# EAGLE design W070 (EAGLE 6.6.0)
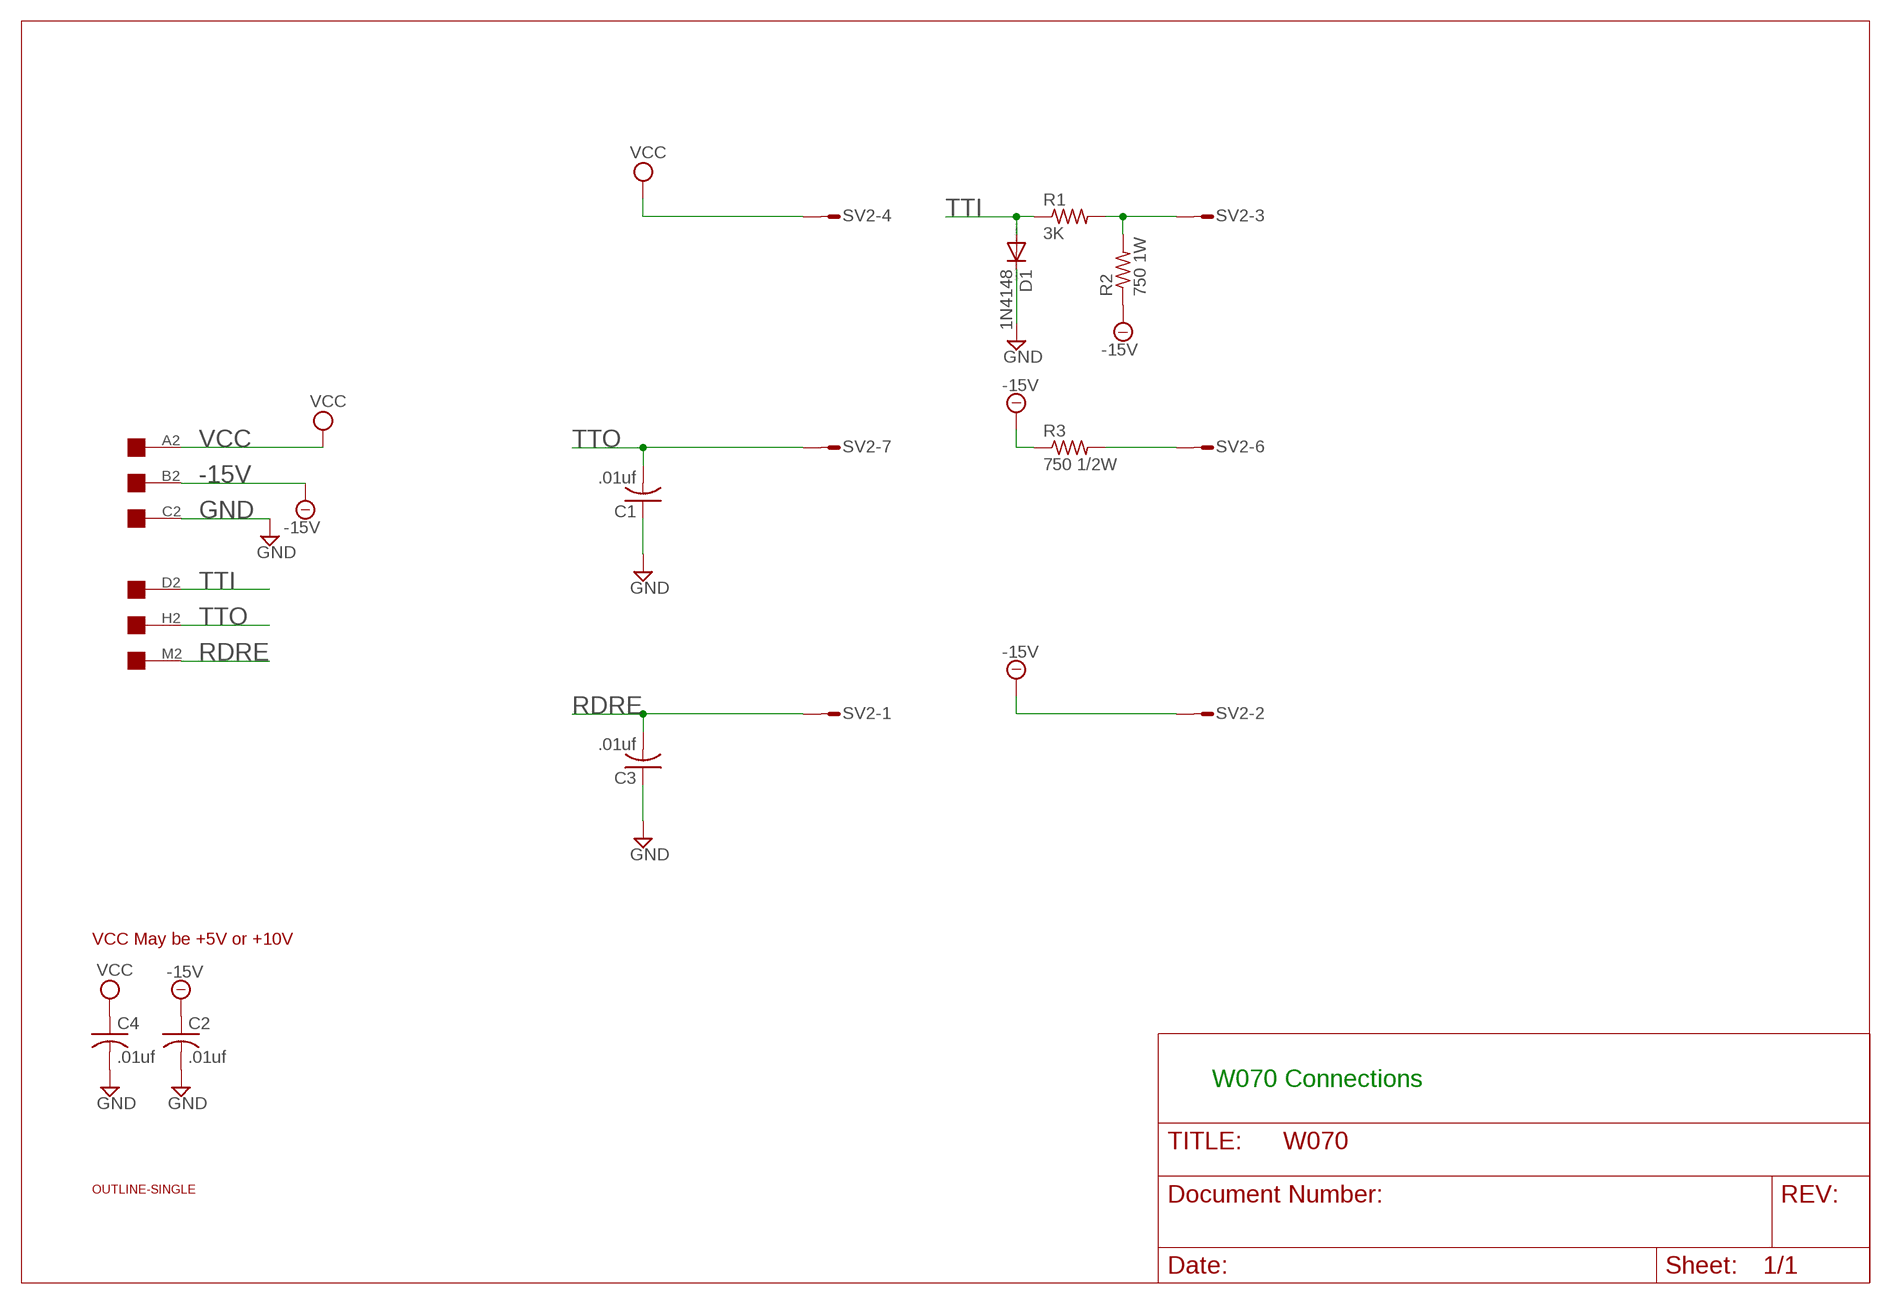
[diagram p0: schematic, sheet 1]

## Parts
C1  .01uf  C-US050-025X075  [C050-025X075]
C2  .01uf  C-US050-025X075  [C050-025X075]
C3  .01uf  C-US050-025X075  [C050-025X075]
C4  .01uf  C-US050-025X075  [C050-025X075]
D1  1N4148  1N4148DO35-10  [DO35-10]
EDGE  EDGE-1  [EDGE-CON1]
R1  3K  R-US_0207/10  [0207/10]
R2  750 1W  R-US_0309/12  [0309/12]
R3  750 1/2W  R-US_0309/12  [0309/12]
SV2  L08P  [L08P]
U$1  OUTLINE-SINGLE  [SINGLE]

## Nets
-15V: C2.1 EDGE.B2 R2.1 R3.1 SV2.2
GND: C1.1 C2.2 C3.1 C4.2 D1.C EDGE.C2
N$1: R3.2 SV2.6
N$2: R1.2 R2.2 SV2.3
RDRE: C3.2 EDGE.M2 SV2.1
TTI: D1.A EDGE.D2 R1.1
TTO: C1.2 EDGE.H2 SV2.7
VCC: C4.1 EDGE.A2 SV2.4
Unconnected: EDGE.E2 EDGE.F2 EDGE.J2 EDGE.K2 EDGE.L2 EDGE.N2 EDGE.P2 EDGE.R2 EDGE.S2 EDGE.T2 EDGE.U2 EDGE.V2 SV2.5 SV2.8

## Notes on the sheet
- VCC May be +5V or +10V
- W070 Connections

## Library data of the parts
C1-C4 = rcl:C-US: CAPACITOR, American symbol
D1 = diode:1N4148: DIODE high speed (Philips)
EDGE = dec-con:EDGE-1: Single-Sided DEC Edge Connector -- (side 2)
R1-R3 = rcl:R-US_: RESISTOR, American symbol
SV2 = con-amp-mt:L08P: AMP MT CONNECTOR; OC_FARNELL: unknown; OC_NEWARK: unknown
U$1 = dec-con:OUTLINE-*: Board outlines for DEC boards.

## Board
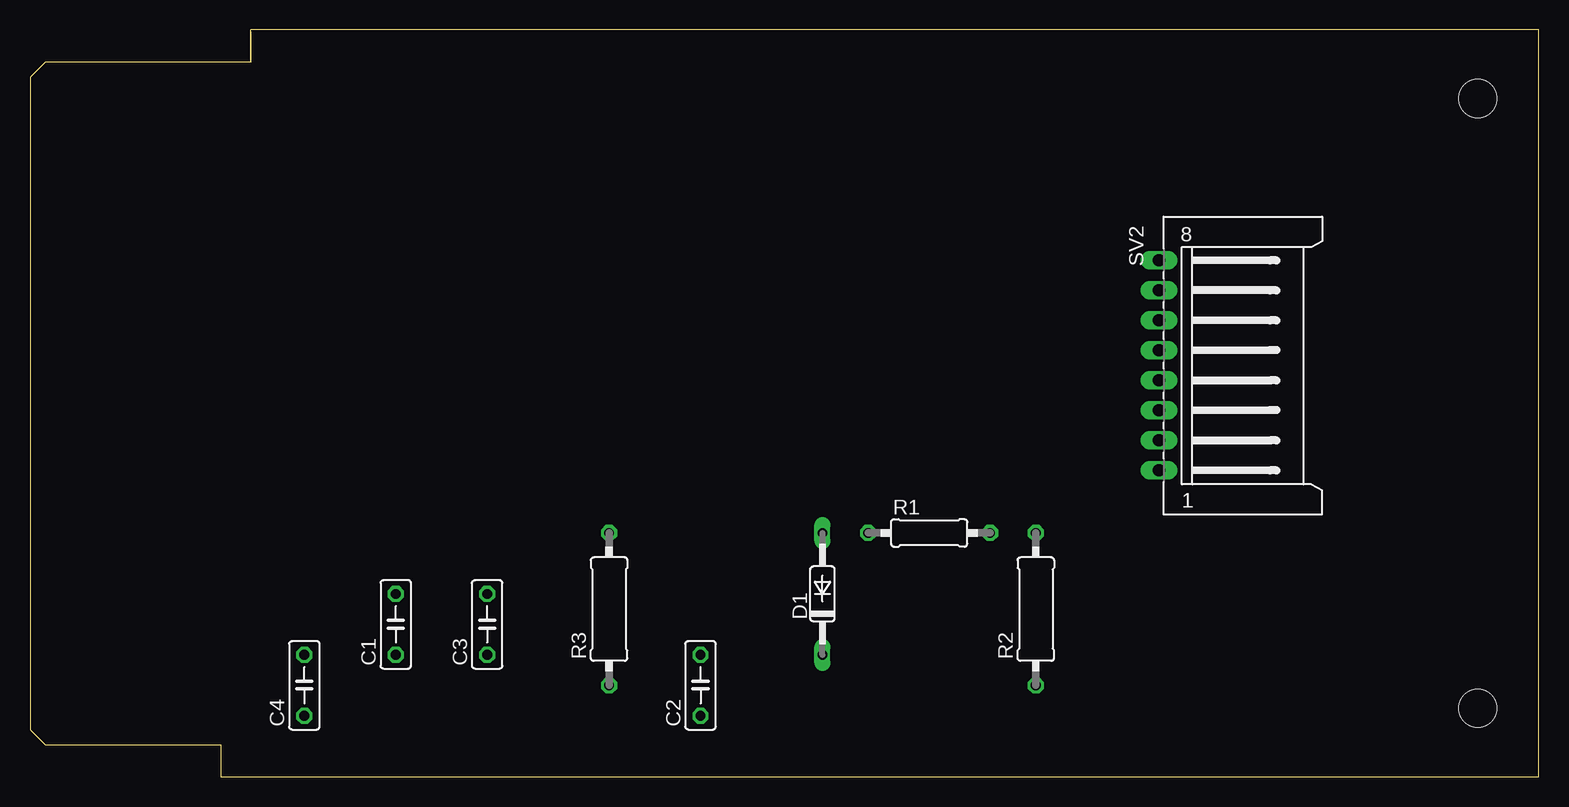
[diagram p1: board, top side]
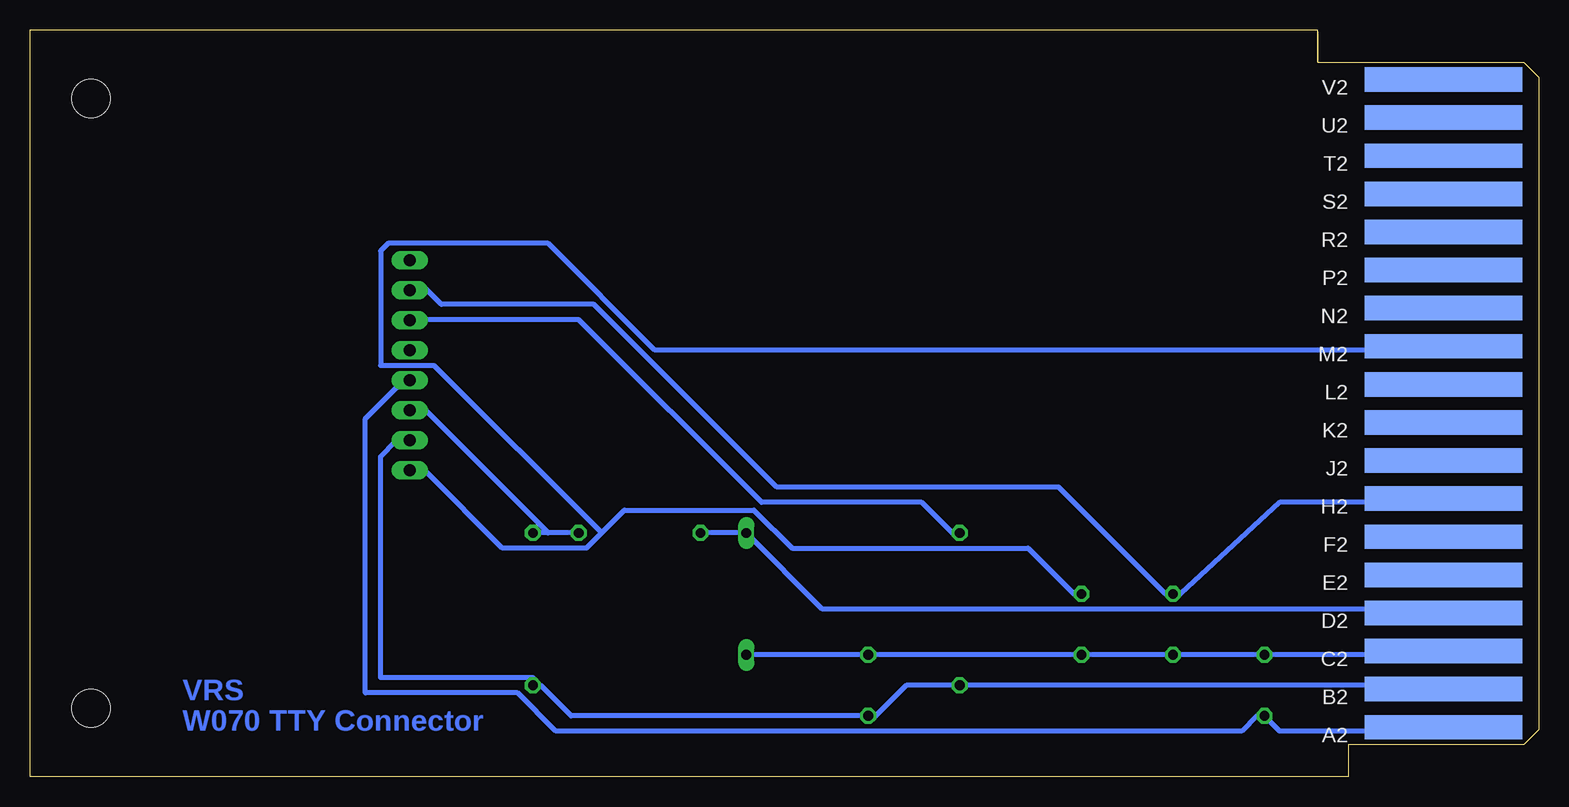
[diagram p2: board, bottom side, seen from below]

Size 125.73 x 62.23 mm. Coordinates in mm from the lower left corner, seen from the top.
Copper layers (1+16): Top 0.035mm / dielectric 1.5mm / Bottom 0.035mm
Design rules "16mils": minimum track width 16mil, minimum drill 32mil, track to track 15mil, track to pad 10mil, pad to pad 10mil, via to via 10mil, smd to smd 10mil, copper to edge 13mil, drill to drill 10mil, minimum pad ring 10mil, minimum via ring 8mil, stop-mask expansion 0mil, vias tented up to drill 0mil, thermal gap 10mil

### Footprints (pad centres in the part's own frame; a part is rotated, then mirrored left to right if it is on the bottom)
C050-025X075 = drill 0.813 octagon: 1 -2.54,0; 2 2.54,0
DO35-10 = drill 0.813 long: A 5.08,0; C -5.08,0
EDGE-CON1 = smd 13.106 x 2.032 bottom: A2 7.938,4.128; B2 7.938,7.303; C2 7.938,10.477; D2 7.938,13.652; E2 7.938,16.828; F2 7.938,20.003; H2 7.938,23.177; J2 7.938,26.352; K2 7.938,29.527; L2 7.938,32.703; M2 7.938,35.877; N2 7.938,39.053; P2 7.938,42.227; R2 7.938,45.403; S2 7.938,48.578; T2 7.938,51.752; U2 7.938,54.928; V2 7.938,58.102
0207/10 = drill 0.813 octagon: 1 -5.08,0; 2 5.08,0
0309/12 = drill 0.813 octagon: 1 -6.35,0; 2 6.35,0
L08P = drill 1.016 long: 1 8.75,-6.25; 2 6.25,-6.25; 3 3.75,-6.25; 4 1.25,-6.25; 5 -1.25,-6.25; 6 -3.75,-6.25; 7 -6.25,-6.25; 8 -8.75,-6.25
SINGLE = hole 3.175: 120.65,56.515; 120.65,5.715

### Placement (x,y rotation side)
C1  30.48,12.7 90 top
C2  55.88,7.62 90 top
C3  38.1,12.7 90 top
C4  22.86,7.62 90 top
D1  66.04,15.24 90 top
EDGE  0,0 0 top
R1  74.93,20.32 0 top
R2  83.82,13.97 90 top
R3  48.26,13.97 90 top
SV2  100.33,34.29 270 top
U$1  0,0 0 top

### Tracks (layer width: path | path; a pad name or v marks a point on that pad's centre or on a via)
-15V
  Bottom 0.406: SV2.2 95.25,27.94 96.52,26.67 96.52,8.26 83.82,8.26 R2.1 83.19,7.62 80.65,5.08 C2.1 55.25,5.08 52.71,7.62 R3.1 13.97,7.62 EDGE.B2
GND
  Bottom 0.406: D1.C C2.2 C3.1 C1.1 C4.2 13.97,10.16 EDGE.C2
N$1
  Bottom 0.406: R3.2 48.9,20.32 51.44,22.86 64.77,22.86 80.01,38.1 92.71,38.1 SV2.6
N$2
  Bottom 0.406: R1.2 82.55,20.32 | 82.55,20.32 R2.2 | 82.55,20.32 92.71,30.48 SV2.3
RDRE
  Bottom 0.406: 78.11,20.32 79.38,19.05 86.36,19.05 92.71,25.4 SV2.1 | 78.11,20.32 76.2,22.23 65.41,22.23 62.23,19.05 42.55,19.05 38.74,15.24 C3.2 | 78.11,20.32 92.08,34.29 96.52,34.29 96.52,43.81 95.89,44.45 82.55,44.45 73.66,35.56 12.7,35.56 EDGE.M2
TTI
  Bottom 0.406: R1.1 D1.A 59.69,13.97 13.97,13.97 EDGE.D2
TTO
  Bottom 0.406: EDGE.H2 12.7,22.86 21.59,22.86 29.85,15.24 C1.2 31.12,15.24 40.01,24.13 63.5,24.13 78.74,39.37 91.44,39.37 92.71,40.64 SV2.7
VCC
  Bottom 0.406: EDGE.A2 13.97,3.81 21.59,3.81 C4.1 23.5,5.08 24.77,3.81 81.92,3.81 85.09,6.99 97.79,6.99 97.79,29.84 95.25,32.38 SV2.4

### Text on the board
Bottom: VRS | W070 TTY Connector